# EAGLE design power-supply (EAGLE 8.7.0)
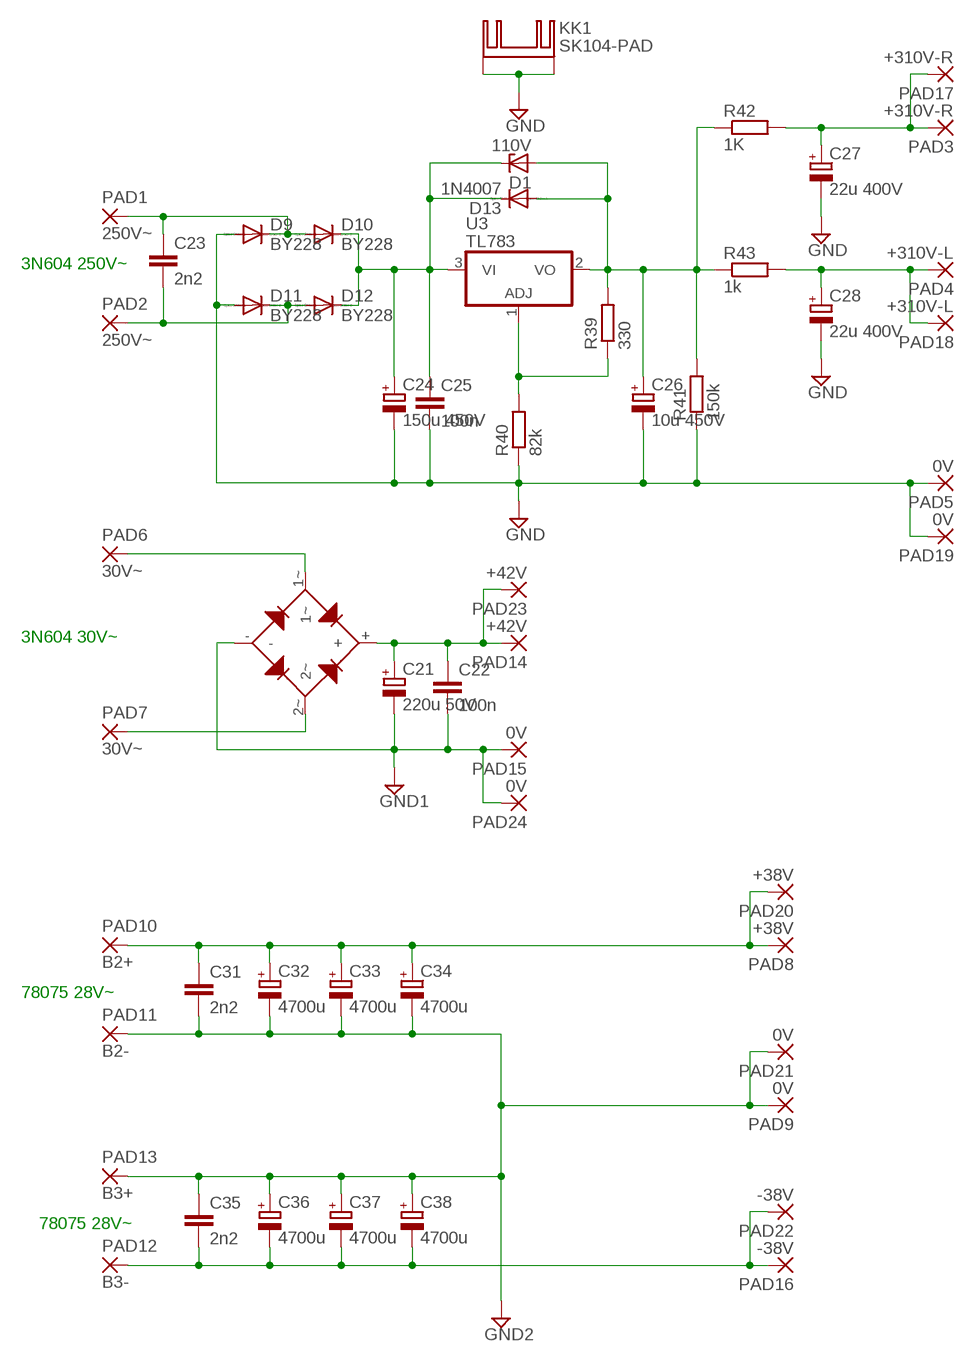
[diagram p0: schematic, sheet 1]

## Parts
C21  220u 50V  CPOL-EUE5-10.5  [E5-10,5]
C22  100n  C-EU050-025X075  [C050-025X075]
C23  2n2  C-EU225-087X268  [C225-087X268]
C24  150u 450V  CPOL-EUE7.5-18  [E7,5-18]
C25  100n  C-EU150-054X183  [C150-054X183]
C26  10u 450V  CPOL-EUE7.5-16  [E7,5-16]
C27  22u 400V  CPOL-EUE5-13  [E5-13]
C28  22u 400V  CPOL-EUE5-13  [E5-13]
C31  2n2  C-EU225-087X268  [C225-087X268]
C32  4700u  CPOL-EUE10-35  [EB35D]
C33  4700u  CPOL-EUE10-35  [EB35D]
C34  4700u  CPOL-EUE10-35  [EB35D]
C35  2n2  C-EU225-087X268  [C225-087X268]
C36  4700u  CPOL-EUE10-35  [EB35D]
C37  4700u  CPOL-EUE10-35  [EB35D]
C38  4700u  CPOL-EUE10-35  [EB35D]
D1  110V  ZENER-DIODEF126-10  [F126Z10]
D9  BY228  [SOD64-10]
D10  BY228  [SOD64-10]
D11  BY228  [SOD64-10]
D12  BY228  [SOD64-10]
D13  1N4007  1N4004  [DO41-10]
KK1  SK104-PAD  [SK104-PAD]
PAD1  250V~  WIREPAD3,81/1,4  [3,81/1,4]
PAD2  250V~  WIREPAD3,81/1,4  [3,81/1,4]
PAD3  +310V-R  WIREPAD3,81/1,4  [3,81/1,4]
PAD4  +310V-L  WIREPAD3,81/1,4  [3,81/1,4]
PAD5  0V  WIREPAD3,81/1,4  [3,81/1,4]
PAD6  30V~  WIREPAD3,81/1,4  [3,81/1,4]
PAD7  30V~  WIREPAD3,81/1,4  [3,81/1,4]
PAD8  +38V  WIREPAD3,81/1,4  [3,81/1,4]
PAD9  0V  WIREPAD3,81/1,4  [3,81/1,4]
PAD10  B2+  WIREPAD3,81/1,4  [3,81/1,4]
PAD11  B2-  WIREPAD3,81/1,4  [3,81/1,4]
PAD12  B3-  WIREPAD3,81/1,4  [3,81/1,4]
PAD13  B3+  WIREPAD3,81/1,4  [3,81/1,4]
PAD14  +42V  WIREPAD3,81/1,4  [3,81/1,4]
PAD15  0V  WIREPAD3,81/1,4  [3,81/1,4]
PAD16  -38V  WIREPAD3,81/1,4  [3,81/1,4]
PAD17  +310V-R  WIREPAD3,81/1,4  [3,81/1,4]
PAD18  +310V-L  WIREPAD3,81/1,4  [3,81/1,4]
PAD19  0V  WIREPAD3,81/1,4  [3,81/1,4]
PAD20  +38V  WIREPAD3,81/1,4  [3,81/1,4]
PAD21  0V  WIREPAD3,81/1,4  [3,81/1,4]
PAD22  -38V  WIREPAD3,81/1,4  [3,81/1,4]
PAD23  +42V  WIREPAD3,81/1,4  [3,81/1,4]
PAD24  0V  WIREPAD3,81/1,4  [3,81/1,4]
R39  330  R-EU_0207/7  [0207/7]
R40  82k  R-EU_0617/22  [0617/22]
R41  150k  R-EU_0617/22  [0617/22]
R42  1K  R-EU_0309/12  [0309/12]
R43  1k  R-EU_0309/12  [0309/12]
U3  TL783  MC33269T  [TO220V]
U$1  W10G  [WOG]

## Nets
GND: C24.- C25.2 C26.- C27.- C28.- D9.A D11.A KK1.K1(K) KK1.K2(K) PAD5.1(P) PAD19.1(P) R40.1 R41.1
GND1: C21.- C22.2 PAD15.1(P) PAD24.1(P) U$1.-
GND2: C31.2 C32.- C33.- C34.- C35.1 C36.+ C37.+ C38.+ PAD9.1(P) PAD11.1(P) PAD13.1(P) PAD21.1(P)
N$1: C23.1 D9.C D10.A PAD1.1(P)
N$2: C23.2 D11.C D12.A PAD2.1(P)
N$3: C27.+ PAD3.1(P) PAD17.1(P) R42.2
N$4: C24.+ C25.1 D1.C D10.C D12.C D13.C U3.3(VI)
N$5: R39.1 R40.2 U3.1(ADJ)
N$6: C26.+ D1.A D13.A R39.2 R41.2 R42.1 R43.1 U3.2(VO)
N$7: C28.+ PAD4.1(P) PAD18.1(P) R43.2
N$8: PAD6.1(P) U$1.1~
N$9: PAD7.1(P) U$1.2~
N$10: C31.1 C32.+ C33.+ C34.+ PAD8.1(P) PAD10.1(P) PAD20.1(P)
N$13: C35.2 C36.- C37.- C38.- PAD12.1(P) PAD16.1(P) PAD22.1(P)
N$15: C21.+ C22.1 PAD14.1(P) PAD23.1(P) U$1.+

## Notes on the sheet
- 3N604 250V~
- 3N604 30V~
- 78075 28V~
- 78075 28V~

## Library data of the parts
C21 C24 C26-C28 C32-C34 C36-C38 = rcl:CPOL-EU: POLARIZED CAPACITOR, European symbol; SPICEPREFIX: C
C22 C23 C25 C31 C35 = rcl:C-EU: CAPACITOR, European symbol; SPICEPREFIX: C
D1 = diode:ZENER-DIODE: Z-Diode
D9-D12 = diode:BY228: DIODE damper diode
D13 = diode:1N4004: DIODE general purpose rectifier, 1 A; SPICEPREFIX: D
KK1 = heatsink:SK104-PAD: HEATSINK manufacturer Fischer/distributor Buerklin
PAD1-PAD24 = wirepad:WIREPAD: Wire PAD connect wire on PCB
R39-R43 = rcl:R-EU_: RESISTOR, European symbol; SPICEPREFIX: R
U3 = linear:MC33269?*: Adjustable Output Low Dropout Voltage Regulator 800 mA Source: http://www.onsemi.com/pub/Collateral/MC33269-D.PDF
U$1 = mugen:W10G

## Board
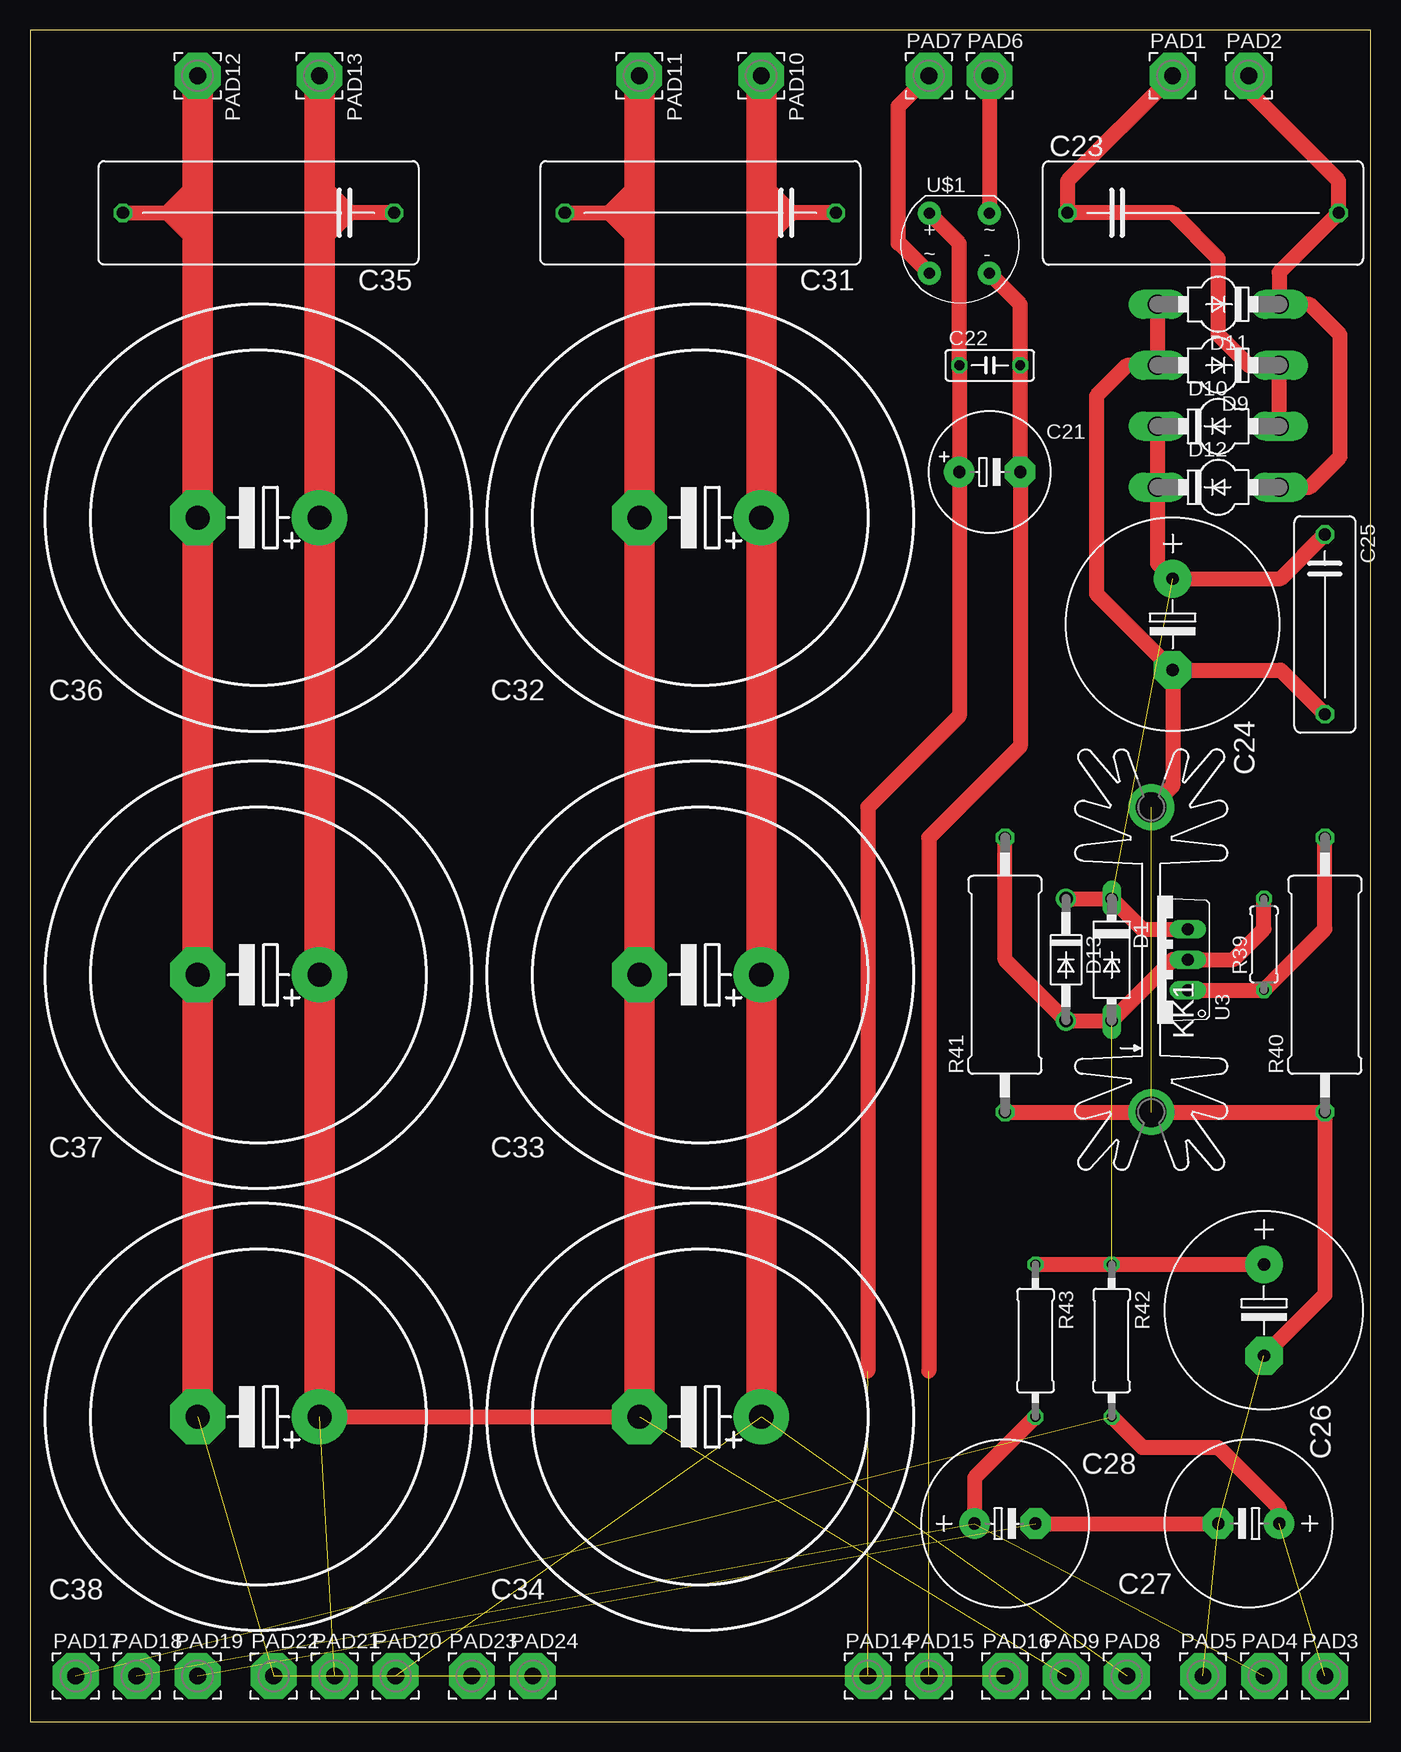
[diagram p1: board, top side]

Size 111.76 x 140.97 mm. Coordinates in mm from the lower left corner, seen from the top.
Outline: 0,0 111.76,0 111.76,140.97 0,140.96 0,0
Copper layers (1*16): Top 0.035mm / dielectric 1.5mm / Bottom 0.035mm
Design rules "default": minimum track width 6mil, minimum drill 0.35mm, track to track 6mil, track to pad 6mil, pad to pad 6mil, via to via 6mil, smd to smd 6mil, copper to edge 40mil, drill to drill 6mil, minimum pad ring 10mil, minimum via ring 8mil, stop-mask expansion 4mil, vias tented up to drill 0mil, thermal gap 10mil

### Footprints (pad centres in the part's own frame; a part is rotated, then mirrored left to right if it is on the bottom)
E5-10,5 = drill 1.016 pad 2.54: + -2.54,0 | drill 1.016 pad 2.54 octagon: - 2.54,0
C050-025X075 = drill 0.813 octagon: 1 -2.54,0; 2 2.54,0
C225-087X268 = drill 1.016 octagon: 1 -11.303,0; 2 11.303,0
E7,5-18 = drill 1.016 pad 3.15: + -3.81,0 | drill 1.016 pad 3.15 octagon: - 3.81,0
C150-054X183 = drill 1.016 octagon: 1 -7.493,0; 2 7.493,0
E7,5-16 = drill 1.016 pad 3.15: + -3.81,0 | drill 1.016 pad 3.15 octagon: - 3.81,0
E5-13 = drill 1.016 pad 2.54: + -2.54,0 | drill 1.016 pad 2.54 octagon: - 2.54,0
EB35D = drill 2.007 pad 4.597: + -5.08,0 | drill 2.007 pad 4.597 octagon: - 5.08,0
F126Z10 = drill 1.016 long: A 5.08,0; C -5.08,0
SOD64-10 = drill 1.6 long: A 5.08,0; C -5.08,0
DO41-10 = drill 1.118: A 5.08,0; C -5.08,0
SK104-PAD = drill 2.54 pad 3.81: K1 -12.7,-0.762; K2 12.7,-0.762
3,81/1,4 = drill 1.397 pad 3.81 octagon: 1 0,0
0207/7 = drill 0.813 octagon: 1 -3.81,0; 2 3.81,0
0617/22 = drill 1.016 octagon: 1 -11.43,0; 2 11.43,0
0309/12 = drill 0.813 octagon: 1 -6.35,0; 2 6.35,0
TO220V = drill 1.016 long: 1 -2.54,-2.54; 2 0,-2.54; 3 2.54,-2.54
WOG = drill 0.9 pad 1.93: 1~ 2.5,2.5; 2~ -2.5,-2.5; + -2.5,2.5; - 2.5,-2.5

### Placement (x,y rotation side)
C21  80.01,104.14 0 top
C22  80.01,113.03 0 top
C23  97.79,125.73 0 top
C24  95.25,91.44 270 top
C25  107.95,91.44 270 top
C26  102.87,34.29 270 top
C27  101.6,16.51 180 top
C28  81.28,16.51 0 top
C31  55.88,125.73 180 top
C32  55.88,100.33 180 top
C33  55.88,62.23 180 top
C34  55.88,25.4 180 top
C35  19.05,125.73 180 top
C36  19.05,100.33 180 top
C37  19.05,62.23 180 top
C38  19.05,25.4 180 top
D1  90.17,63.5 270 top
D9  99.06,113.03 180 top
D10  99.06,107.95 0 top
D11  99.06,118.11 180 top
D12  99.06,102.87 0 top
D13  86.36,63.5 270 top
KK1  92.71,63.5 90 top
PAD1  95.25,137.16 0 top
PAD2  101.6,137.16 0 top
PAD3  107.95,3.81 0 top
PAD4  102.87,3.81 0 top
PAD5  97.79,3.81 0 top
PAD6  80.01,137.16 0 top
PAD7  74.93,137.16 0 top
PAD8  91.44,3.81 0 top
PAD9  86.36,3.81 0 top
PAD10  60.96,137.16 270 top
PAD11  50.8,137.16 270 top
PAD12  13.97,137.16 270 top
PAD13  24.13,137.16 270 top
PAD14  69.85,3.81 0 top
PAD15  74.93,3.81 0 top
PAD16  81.28,3.81 0 top
PAD17  3.81,3.81 0 top
PAD18  8.89,3.81 0 top
PAD19  13.97,3.81 0 top
PAD20  30.48,3.81 0 top
PAD21  25.4,3.81 0 top
PAD22  20.32,3.81 0 top
PAD23  36.83,3.81 0 top
PAD24  41.91,3.81 0 top
R39  102.87,64.77 90 top
R40  107.95,62.23 90 top
R41  81.28,62.23 90 top
R42  90.17,31.75 270 top
R43  83.82,31.75 270 top
U3  93.98,63.5 90 top
U$1  77.47,123.19 0 top

### Tracks (layer width: path | path; a pad name or v marks a point on that pad's centre or on a via)
GND  (4 unrouted)
  Top 1.27: D11.A D9.A 91.44,113.03 88.9,110.49 88.9,93.98 C24.- | C24.- 95.25,77.98 KK1.K2 | C24.- 104.27,87.63 C25.2 | R41.1 KK1.K1 R40.1 107.95,35.56 C26.- | C28.- C27.-
GND1  (2 unrouted)
  Top 1.27: U$1.- 82.55,118.11 C22.2 C21.- 82.55,81.28 74.93,73.66 74.93,29.21
GND2  (2 unrouted)
  Top 1.27: 48.26,125.73 50.8,128.27 | 48.26,125.73 C31.2 50.8,125.73 | 48.26,125.73 50.8,123.19 | 26.67,125.73 24.13,128.27 | 26.67,125.73 C35.1 24.13,125.73 | 26.67,125.73 24.13,123.19 | C38.+ C34.-
  Top 2.54: C38.+ C37.+ C36.+ 24.13,123.19 24.13,125.73 24.13,128.27 PAD13.1 | C34.- C33.- C32.- 50.8,123.19 50.8,125.73 50.8,128.27 PAD11.1
N$1
  Top 1.27: PAD1.1 86.49,128.4 C23.1 95.25,125.73 99.06,121.92 99.06,115.57 101.6,113.03 D9.C D10.A
N$2
  Top 1.27: D12.A 106.68,102.87 109.22,105.41 109.22,115.57 106.68,118.11 D11.C 104.14,120.78 C23.2 109.09,128.4 101.6,135.89 PAD2.1
N$3  (2 unrouted)
  Top 1.27: R42.2 92.71,22.86 99.06,22.86 104.14,17.78 C27.+
N$4  (1 unrouted)
  Top 1.27: D10.C D12.C 93.98,96.52 C24.+ 104.27,95.25 C25.1 | D13.C D1.C 92.71,66.04 U3.3
N$5
  Top 1.27: R40.2 107.95,66.04 R39.1 U3.1
N$6  (1 unrouted)
  Top 1.27: R41.2 81.28,63.5 D13.A D1.A 95.25,63.5 U3.2 100.33,63.5 102.87,66.04 R39.2 | R43.1 88.9,38.1 R42.1 C26.+
N$7  (2 unrouted)
  Top 1.27: R43.2 78.74,20.32 C28.+
N$8
  Top 1.27: U$1.1~ 80.01,125.73 PAD6.1
N$9
  Top 1.27: U$1.2~ 72.47,123.19 72.39,123.19 72.39,134.62 PAD7.1
N$10  (2 unrouted)
  Top 1.27: 63.5,125.73 60.96,123.19 | 63.5,125.73 C31.1 60.96,125.73 | 63.5,125.73 60.96,128.27
  Top 2.54: C34.+ C33.+ C32.+ 60.96,123.19 60.96,125.73 60.96,128.27 PAD10.1
N$13  (2 unrouted)
  Top 1.27: 11.43,125.73 13.97,128.27 | 11.43,125.73 C35.2 13.97,125.73 | 11.43,125.73 13.97,123.19
  Top 2.54: C38.- C37.- C36.- 13.97,123.19 13.97,125.73 13.97,128.27 PAD12.1
N$15  (2 unrouted)
  Top 1.27: U$1.+ 77.47,123.19 C22.1 C21.+ 77.47,83.82 69.85,76.2 69.85,29.21